# Altium schematic sheet single-pwm.SchDoc
size Letter; SheetNumber: 2; SheetTotal: 2
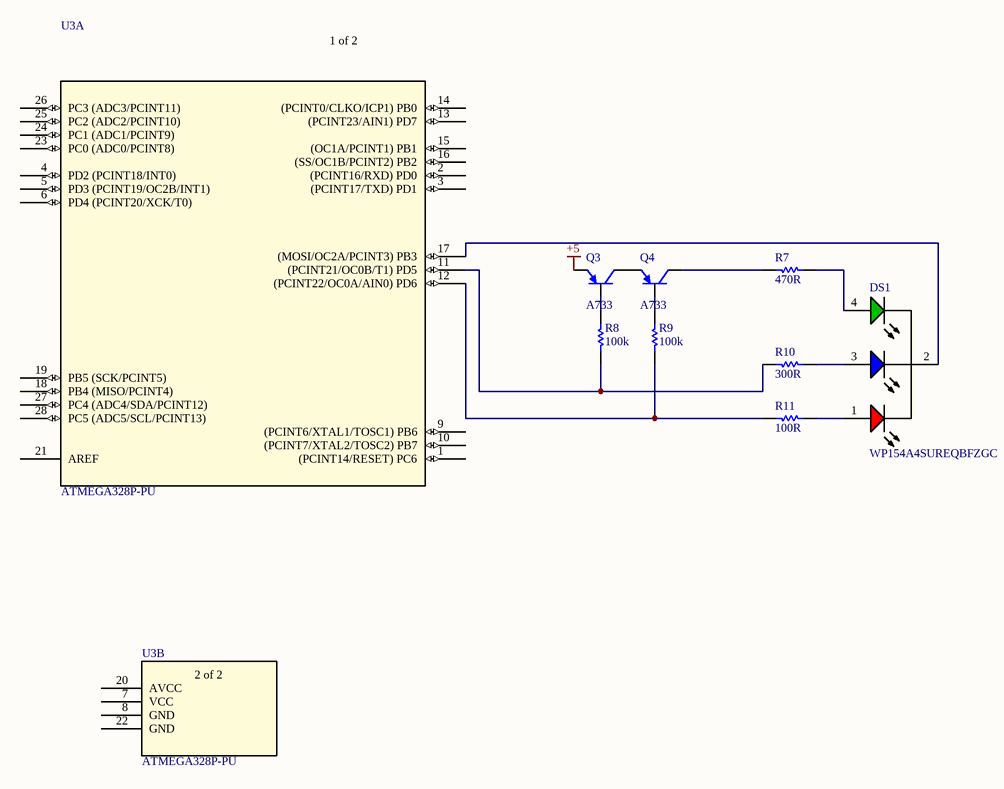
[diagram p0: single-pwm.SchDoc]

## Parts
DS1  WP154A4SUREQBFZGC  [KING-WP154A4SUREQBFZGC_V]
Q3  A733  [TO-92_ONS]
Q4  A733  [TO-92_ONS]
R7  470R  [RES_TOP_1]
R8  100k  [RES_TOP_1]
R9  100k  [RES_TOP_1]
R10  300R  [RES_TOP_1]
R11  100R  [RES_TOP_1]
U3  ATMEGA328P-PU  [28P3_ATM]  (parts A,B of 2)

## Nets
+5: Q3.1(E)
NetDS1_1: DS1.1(RED) R11.2
NetDS1_2: DS1.2(CATHODE) U3.17((MOSI/OC2A/PCINT3)_PB3)
NetDS1_3: DS1.3(BLUE) R10.2
NetDS1_4: DS1.4(GREEN) R7.2
NetQ3_2: Q3.2(C) Q4.1(E)
NetQ3_3: Q3.3(B) R8.2
NetQ4_2: Q4.2(C) R7.1
NetQ4_3: Q4.3(B) R9.2
NetR8_1: R8.1 R10.1 U3.11((PCINT21/OC0B/T1)_PD5)
NetR9_1: R9.1 R11.1 U3.12((PCINT22/OC0A/AIN0)_PD6)

Not connected (* = marked no-connect by the designer): U3 1((PCINT14/RESET)_PC6) 2((PCINT16/RXD)_PD0) 3((PCINT17/TXD)_PD1) 4(PD2_(PCINT18/INT0)) 5(PD3_(PCINT19/OC2B/INT1)) 6(PD4_(PCINT20/XCK/T0)_) 7(VCC) 8(GND) 9((PCINT6/XTAL1/TOSC1)_PB6) 10((PCINT7/XTAL2/TOSC2)_PB7) 13((PCINT23/AIN1)_PD7) 14((PCINT0/CLKO/ICP1)_PB0) 15((OC1A/PCINT1)_PB1) 16((SS/OC1B/PCINT2)_PB2) 18(PB4_(MISO/PCINT4)) 19(PB5_(SCK/PCINT5)) 20(AVCC) 21(AREF) 22(GND) 23(PC0_(ADC0/PCINT8)) 24(PC1_(ADC1/PCINT9)) 25(PC2_(ADC2/PCINT10)) 26(PC3_(ADC3/PCINT11)) 27(PC4_(ADC4/SDA/PCINT12)) 28(PC5_(ADC5/SCL/PCINT13))

## Notes on the sheet
- (in symbol ATMEGA328P-PU, part A) 1 of 2
- (in symbol ATMEGA328P-PU, part B) 2 of 2

## Library data of the parts
DS1 = CMP-2000-07415-1: Full Color LED Lamp, Dominant Wavelength RGB 630 / 525 / 465 nm, -40 to 85 degC, 4-Pin THD, RoHS; Manufacturer: Kingbright; Viewing Angle: 50°; Wavelength - Dominant: 630nm,525nm,465nm; Online Catalog: 5mm,T-13/4(RGB)RoundwithDomedTopLEDLamp; Millicandela Rating: 1300mcdRed,1700mcdGreen,900mcdBlue; Other Names: 754-1615 / WP154A4SUREQBFZGC-ND; Current - Test: 20mA; Wavelength - Peak: 645nm,515nm,460nm; Color: Red,Green,Blue(RGB); Voltage - Forward (Vf) (Typ): 1.9VRed,3.3VGreen,3.3VBlue; Lens Type: Clear; 3D Model: WP154A4SUREQBFZGW.sldprt / WP154A4SUREQBFZGW.pro / WP154A4SUREQBFZGW.igs / WP154A4SUREQBFZGW.stp; Lens Style/Size: RoundwithDomedTop,5mm,T-13/4; Packaging: Bulk; Datasheet URL: https://www.kingbrightusa.com/images/catalog/spec/WP154A4SUREQBFZGC.pdf; Family: LEDIndication-Discrete; Datasheet Version: Rev. 5A, 08/2014; Category: Optoelectronics; Manufacturer URL: http://www.kingbright.com/; Height: 8.60mm; Mounting Type: ThroughHole; Package Reference: WP154A4SUREQBFZGC; Mounting Technology: ThroughHole; Package Description: 4-Pin Through Hole LED, Dia 5.9 mm, Pitch 1.27 mm; Standard Package: 500; Package / Case: Radial-4Leads
Q3 Q4 = A733: PNP General Purpose Transistor; Published: 8-Jun-2000; LatestRevisionDate: 15-Jan-2003; LatestRevisionNote: PCB Footprint 'BCY-W3/D4.7' replaced; DatasheetVersion: 1997; PackageVersion: Sep-1998; PackageReference: TO-92A; Publisher: Altium Limited; PackageDescription: TO, Flat Index; 3 In-Line, Axial Leads; Body Dia. 4.5mm; Leads 0.51 x 0.48 mm (max); ComponentLink1Description: Manufacturer Link; ComponentLink1URL: http://www.fairchildsemi.com/; ComponentLink2Description: Datasheet; ComponentLink2URL: http://www.fairchildsemi.com/ds/2N%2F2N3906.pdf
R7-R11 = Res1: Resistor; Published: 8-Jun-2000; LatestRevisionDate: 17-Jul-2002; LatestRevisionNote: Re-released for DXP Platform.; PackageReference: AXIAL-0.3; Publisher: Altium Limited; PackageDescription: Axial Device, Thru-Hole; 2 Leads; 0.3 in Pin Spacing
  R7: Value: 470R
  R8 R9: Value: 100k
  R10: Value: 300R
  R11: Value: 100R
U3 = ATMEGA328P-PU: No Description Available; Built_By: EMA_UL_Team; Vendor: Atmel; SourceLibrary: Atmel_2011-04-02; Manufacturer_Part_Number: ATMEGA328P-PU; Copyright: Copyright (C) 2018 Accelerated Designs. All rights reserved; RefDes: RefDes; Type: DEV